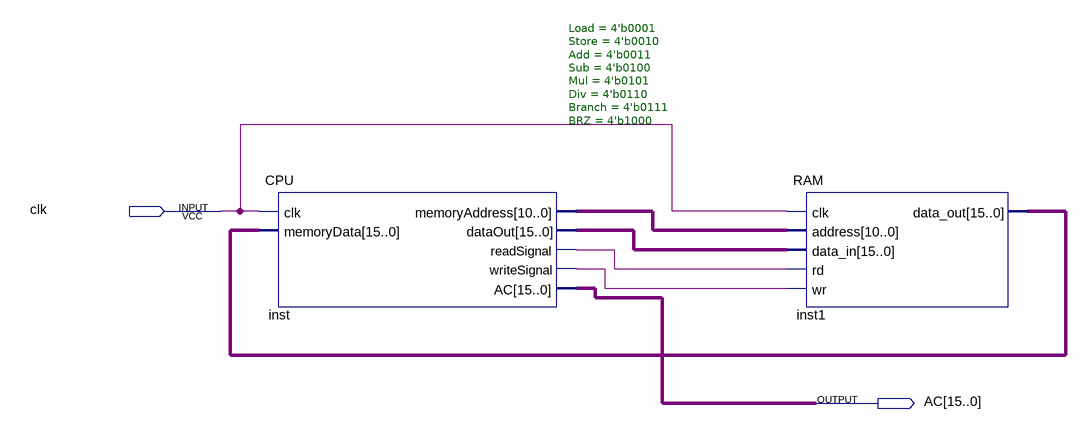
[diagram p0: schematic sheet]
// Quartus schematic ComputerSchematic.bdf as structural Verilog: 2 symbols, 2 pins
module ComputerSchematic (
  input  clk,
  output [15:0] AC
);

  wire inst_readsignal, inst_writesignal;
  wire [10:0] inst_memoryaddress;
  wire [15:0] inst1_data_out, inst_dataout;

  CPU #(.Load(4'b0001), .Store(4'b0010), .Add(4'b0011), .Sub(4'b0100), .Mul(4'b0101), .Div(4'b0110), .Branch(4'b0111), .BRZ(4'b1000)) inst (
    .clk(clk), .memoryData(inst1_data_out), .memoryAddress(inst_memoryaddress), .dataOut(inst_dataout),
    .readSignal(inst_readsignal), .writeSignal(inst_writesignal), .AC(AC));
  RAM inst1 (
    .clk(clk), .address(inst_memoryaddress), .data_in(inst_dataout), .rd(inst_readsignal),
    .wr(inst_writesignal), .data_out(inst1_data_out));
endmodule
